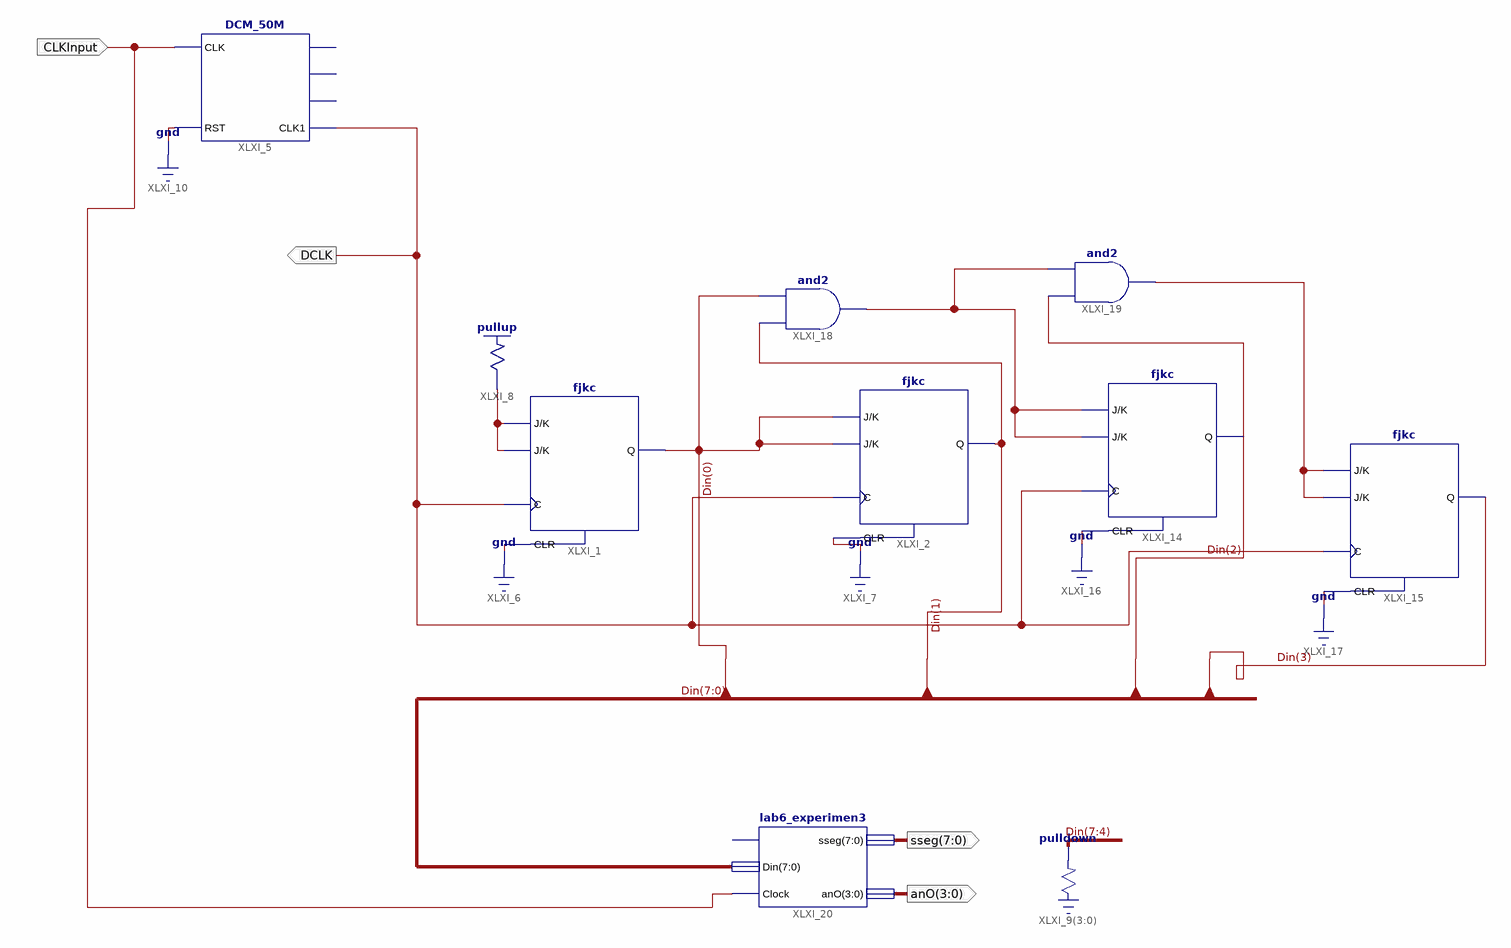
[diagram p0: schematic sheet 1]
// Xilinx ISE schematic lab8_experiment5.sch (spartan3e) as structural Verilog: 10 symbols, 4 ports
module lab8_experiment5 (
  input  CLKInput,
  output [7:0] sseg,
  output [3:0] anO,
  output DCLK
);

  wire XLXN_11, XLXN_30, XLXN_40;
  wire [7:0] Din;

  fjkc XLXI_1 (.C(DCLK), .CLR(1'b0), .J(XLXN_11), .K(XLXN_11), .Q(Din[0]));
  fjkc XLXI_2 (.C(DCLK), .CLR(1'b0), .J(Din[0]), .K(Din[0]), .Q(Din[1]));
  DCM_50M XLXI_5 (.CLK(CLKInput), .RST(1'b0), .CLK1(DCLK));  // open: CLK1M, CLK10k, CLK1k
  \pullup  XLXI_8 (.O(XLXN_11));
  fjkc XLXI_14 (.C(DCLK), .CLR(1'b0), .J(XLXN_30), .K(XLXN_30), .Q(Din[2]));
  fjkc XLXI_15 (.C(DCLK), .CLR(1'b0), .J(XLXN_40), .K(XLXN_40), .Q(Din[3]));
  and XLXI_18 (XLXN_30, Din[1], Din[0]);
  and XLXI_19 (XLXN_40, Din[2], XLXN_30);
  lab6_experimen3 XLXI_20 (.Din(Din), .Clock(CLKInput), .sseg(sseg), .anO(anO));  // open: En
  \pulldown  XLXI_9[3:0] (.O(Din[7:4]));
endmodule
